# Altium project 24V-12V.PrjPcb
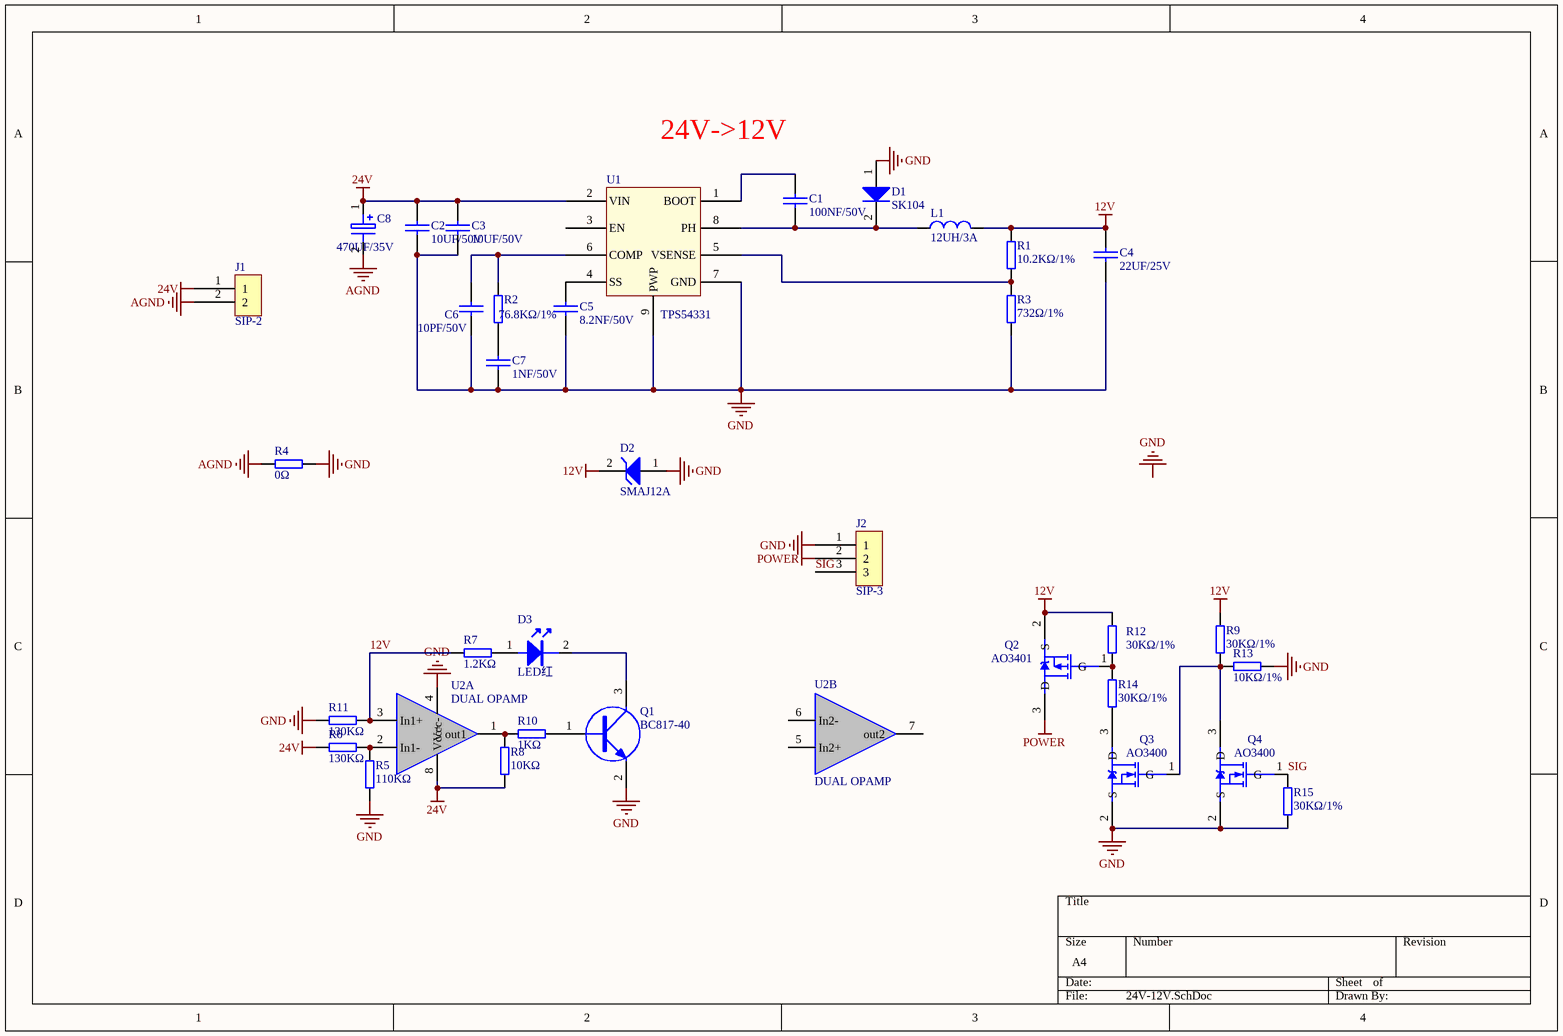
[diagram p0: 24V-12V.SchDoc]
1 sheet, 35 parts. Net scope: global (net labels, ports and power ports of the same name join across sheets).
Board files: 24V-12V.PcbDoc, 24V-12V_5X4.PcbDoc

## Sheet 24V-12V.SchDoc
size A4

### Parts
C1  100NF/50V  [0603_C]
C2  10UF/50V  [1206_C]
C3  10UF/50V  [1206_C]
C4  22UF/25V  [1206_C]
C5  8.2NF/50V  [0603_C]
C6  10PF/50V  [0603_C]
C7  1NF/50V  [0603_C]
C8  470UF/35V  [EC-DIP_BD10.0-P5.00-D1.0-FD]
D1  SK104  [SMC/DO214AB]
D2  SMAJ12A  [SMA/DO214AC]
D3  LED红  [0603_D]
J1  SIP-2  [HB611-6.35-2P]
J2  SIP-3  [KF2EDGV-3.81-3P]
L1  12UH/3A  [IND-SMD_0630]
Q1  BC817-40  [SOT-23-3]
Q2  AO3401  [SOT-23-3]
Q3  AO3400  [SOT-23-3]
Q4  AO3400  [SOT-23-3]
R1  10.2KΩ/1%  [0603_R]
R2  76.8KΩ/1%  [0603_R]
R3  732Ω/1%  [0603_R]
R4  0Ω  [1206_R]
R5  110KΩ  [0603_R]
R6  130KΩ  [0603_R]
R7  1.2KΩ  [0805_R]
R8  10KΩ  [0603_R]
R9  30KΩ/1%  [0603_R]
R10  1KΩ  [0603_R]
R11  130KΩ  [0603_R]
R12  30KΩ/1%  [0603_R]
R13  10KΩ/1%  [0603_R]
R14  30KΩ/1%  [0603_R]
R15  30KΩ/1%  [0603_R]
U1  TPS54331  [SO-8-POWERPAD（1.27/3.8*5）]
U2  DUAL OPAMP  [SO-8（1.27/3.8*5）]  (parts A,B of 2)

### Nets
12V: C4.1 D2.2(K) L1.2 Q2.2(S) R1.2 R7.2 R9.1 R11.2 R12.1 U2.3(In1+)
24V: C2.1 C3.1 C8.1 J1.1 R6.2 R8.1 U1.2(VIN) U2.8(Vcc+)
AGND: C8.2 J1.2 R4.1
GND: C2.2 C3.2 C4.2 C5.2 C6.2 C7.2 D1.1(A) D2.1 J2.1 Q1.2 Q3.2(S) Q4.2(S) R3.1 R4.2 R5.1 R11.1 R13.2 R15.1 U1.7(GND) U1.9(PWP) U2.4(Vcc-)
POWER: J2.2 Q2.3(D)
SIG: J2.3 Q4.1(G) R15.2
NetC1_1: C1.1 U1.1(BOOT)
NetC1_2: C1.2 D1.2(K) L1.1 U1.8(PH)
NetC5_1: C5.1 U1.4(SS)
NetC6_1: C6.1 R2.2 U1.6(COMP)
NetC7_1: C7.1 R2.1
NetD3_1: D3.1 R7.1
NetD3_2: D3.2 Q1.3
NetQ1_1: Q1.1 R10.2
NetQ2_1: Q2.1(G) R12.2 R14.1
NetQ3_1: Q3.1(G) Q4.3(D) R9.2 R13.1
NetQ3_3: Q3.3(D) R14.2
NetR1_1: R1.1 R3.2 U1.5(VSENSE)
NetR5_2: R5.2 R6.1 U2.2(In1-)
NetR8_2: R8.2 R10.1 U2.1(out1)

Not connected (* = marked no-connect by the designer): U1 3(EN); U2 5(In2+) 6(In2-) 7(out2)

### Notes on the sheet
- 24V->12V
- Labels drawn without touching a wire or pin: GND

### Library data of the parts
C1-C7 = CAP: 无极性电容
C8 = CAP POLAR: 电解电容
D1 = Diodes: 肖特基二极管/10A
D2 = Zener diode: 5V 单向TVS; Published: 8-Jun-2000; LatestRevisionDate: 17-Jul-2002; LatestRevisionNote: Re-released for DXP Platform.; PackageReference: DIODE-0.7; Publisher: Altium Limited
D3 = LED: 发光二极管
J1 = SIP-2: 单排2P插座
J2 = SIP-3: 单排3P插座
L1 = INDUCTOR: 电感
Q1 = BC817-40: NPN三极管; Ic: 0.5A; Vceo: 45V; Vcbo: 50V; Vebo: 5V; Pc: 0.3W
Q2 = MOSFET_P: P-Channel MOSFET; PackageDocument: 1995/1996; Published: 8-Jun-2000; LatestRevisionDate: 17-Jul-2002; LatestRevisionNote: Re-released for DXP Platform.; PackageReference: E3; Publisher: Altium Limited
Q3 Q4 = MOSFET-N: N-Channel MOSFET; PackageDocument: 1995/1996; Published: 8-Jun-2000; LatestRevisionDate: 17-Jul-2002; LatestRevisionNote: Re-released for DXP Platform.; PackageReference: E3; Publisher: Altium Limited
R1-R15 = RES2: 电阻
U1 = TPS54531: DC-DC/5A
U2 = DUAL OPAMP: 双运放